# Altium schematic sheet SoC GPIO 3.3V.SchDoc
size A2; DocumentNumber: 11; SheetNumber: 12; SheetTotal: 14
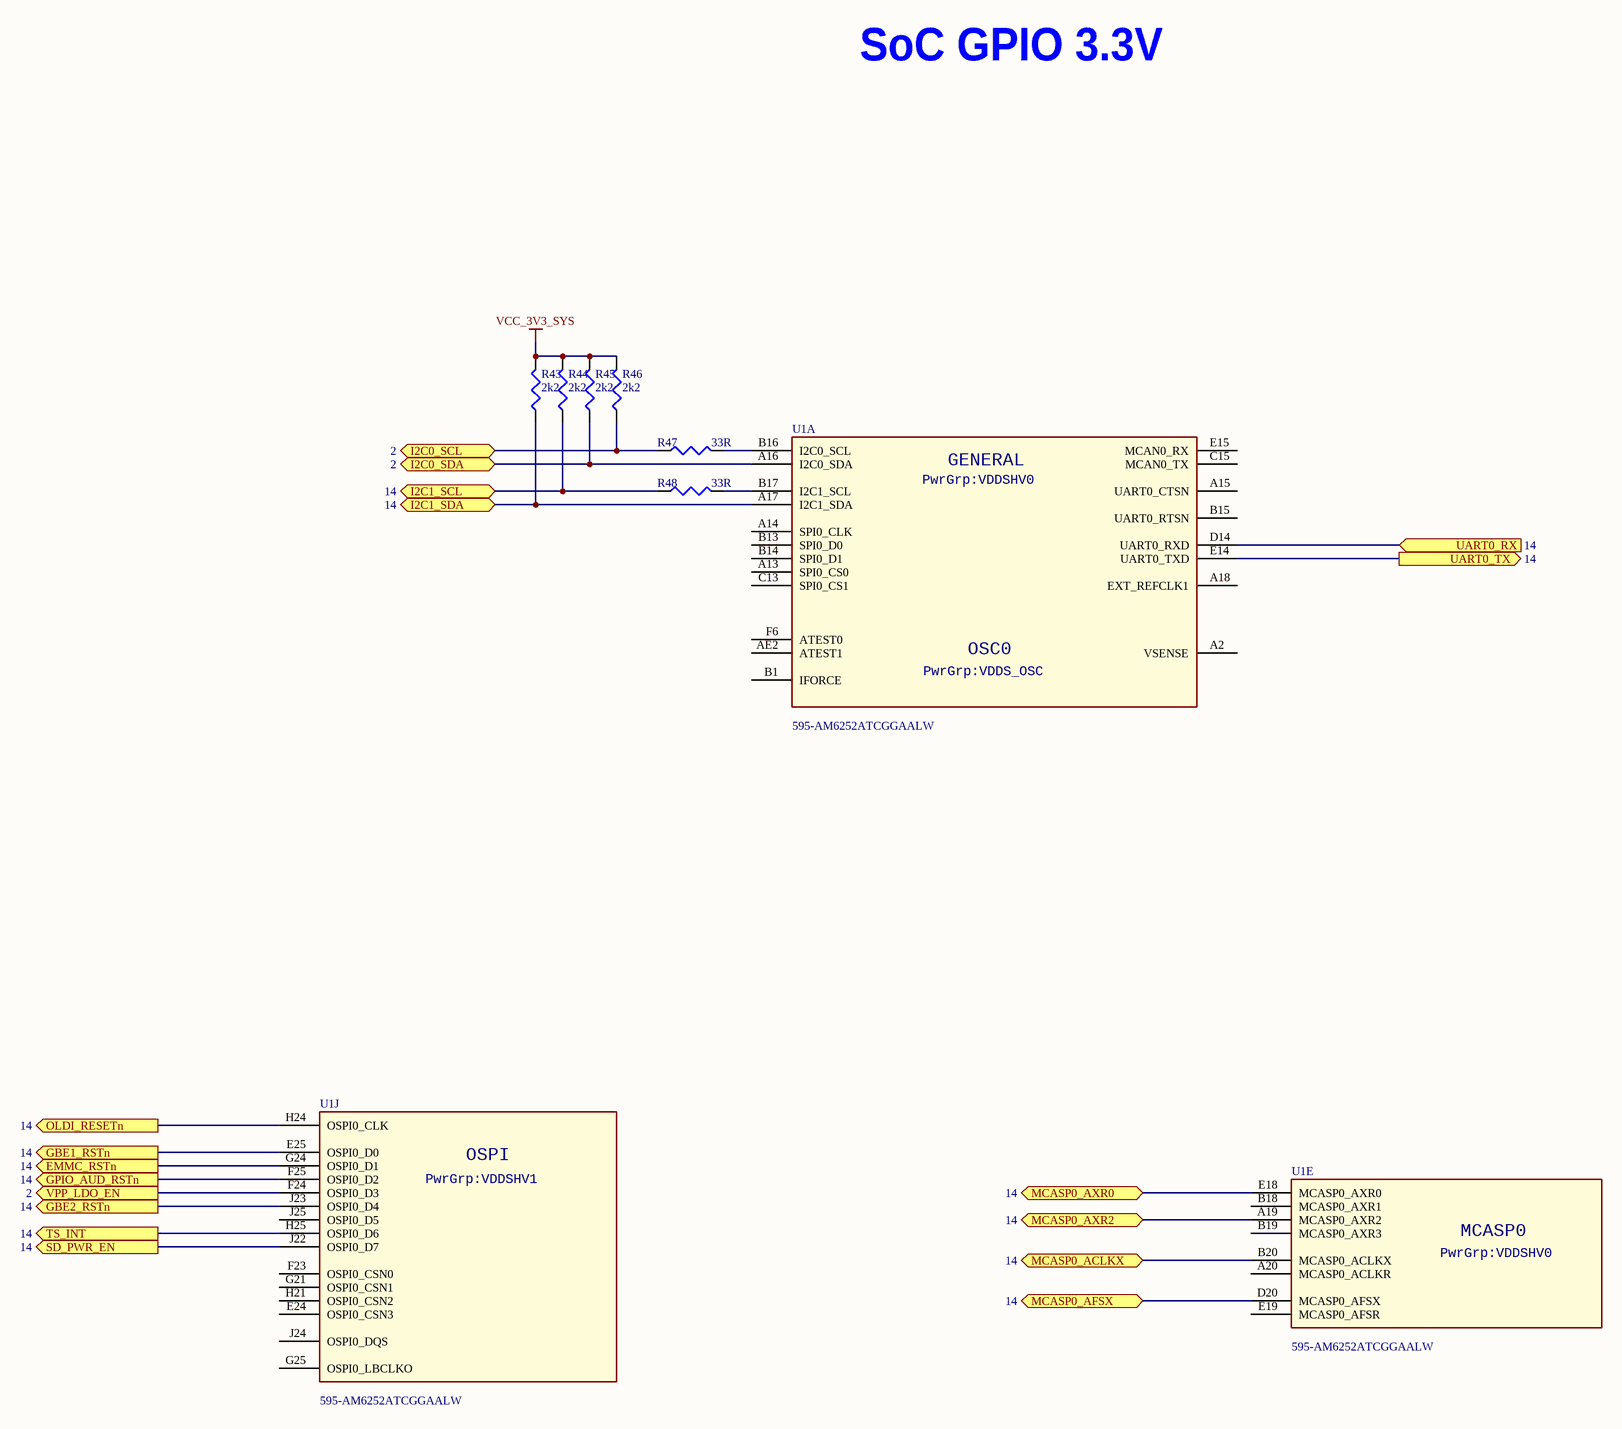
[diagram p0: SoC GPIO 3.3V.SchDoc]

## Parts
R43  2k2  [R0402]
R44  2k2  [R0402]
R45  2k2  [R0402]
R46  2k2  [R0402]
R47  33R  [R0201]
R48  33R  [R0201]
U1  Supplier Part Number 1: 595-AM6252ATCGGAALW  [BGA425C50P25X25_1300X1300X89]  (hidden comment: AM62-EVM_BGA425)  (parts A,E,J of 18)

## Ports
EMMC_RSTn (out, see 14), GBE1_RSTn (out, see 14), GBE2_RSTn (out, see 14), GPIO_AUD_RSTn (out, see 14), I2C0_SCL (bidir, see 2), I2C0_SDA (bidir, see 2), I2C1_SCL (bidir, see 14), I2C1_SDA (bidir, see 14), MCASP0_ACLKX (bidir, see 14), MCASP0_AFSX (bidir, see 14), MCASP0_AXR0 (bidir, see 14), MCASP0_AXR2 (bidir, see 14), OLDI_RESETn (out, see 14), SD_PWR_EN (out, see 14), TS_INT (out, see 14), UART0_RX (in, see 14), UART0_TX (out, see 14), VPP_LDO_EN (out, see 2)

## Nets
VCC_3V3_SYS: R43.2 R44.2 R45.2 R46.2
EMMC_RSTn: U1.G24(OSPI0_D1) ; port EMMC_RSTn
GBE1_RSTn: U1.E25(OSPI0_D0) ; port GBE1_RSTn
GBE2_RSTn: U1.J23(OSPI0_D4) ; port GBE2_RSTn
GPIO_AUD_RSTn: U1.F25(OSPI0_D2) ; port GPIO_AUD_RSTn
I2C0_SCL: R46.1 R47.1 ; port I2C0_SCL
I2C0_SDA: R45.1 U1.A16(I2C0_SDA) ; port I2C0_SDA
I2C1_SCL: R44.1 R48.1 ; port I2C1_SCL
I2C1_SDA: R43.1 U1.A17(I2C1_SDA) ; port I2C1_SDA
MCASP0_ACLKX: U1.B20(MCASP0_ACLKX) ; port MCASP0_ACLKX
MCASP0_AFSX: U1.D20(MCASP0_AFSX) ; port MCASP0_AFSX
MCASP0_AXR0: U1.E18(MCASP0_AXR0) ; port MCASP0_AXR0
MCASP0_AXR2: U1.A19(MCASP0_AXR2) ; port MCASP0_AXR2
OLDI_RESETn: U1.H24(OSPI0_CLK) ; port OLDI_RESETn
SD_PWR_EN: U1.J22(OSPI0_D7) ; port SD_PWR_EN
TS_INT: U1.H25(OSPI0_D6) ; port TS_INT
UART0_RX: U1.D14(UART0_RXD) ; port UART0_RX
UART0_TX: U1.E14(UART0_TXD) ; port UART0_TX
VPP_LDO_EN: U1.F24(OSPI0_D3) ; port VPP_LDO_EN
NetR47_2: R47.2 U1.B16(I2C0_SCL)
NetR48_2: R48.2 U1.B17(I2C1_SCL)

Not connected (* = marked no-connect by the designer): U1 A2(VSENSE) A13(SPI0_CS0) A14(SPI0_CLK) A15(UART0_CTSN) A18(EXT_REFCLK1) A20(MCASP0_ACLKR) AE2(ATEST1) B1(IFORCE) B13(SPI0_D0) B14(SPI0_D1) B15(UART0_RTSN) B18(MCASP0_AXR1) B19(MCASP0_AXR3) C13(SPI0_CS1) C15(MCAN0_TX) E15(MCAN0_RX) E19(MCASP0_AFSR) E24(OSPI0_CSN3) F6(ATEST0) F23(OSPI0_CSN0) G21(OSPI0_CSN1) G25(OSPI0_LBCLKO) H21(OSPI0_CSN2) J24(OSPI0_DQS) J25(OSPI0_D5)

## Notes on the sheet
- SoC GPIO 3.3V
- (in symbol AM62-EVM_BGA425, part A) GENERAL; PwrGrp:VDDSHV0; OSC0; PwrGrp:VDDS_OSC
- (in symbol AM62-EVM_BGA425, part E) MCASP0; PwrGrp:VDDSHV0
- (in symbol AM62-EVM_BGA425, part J) OSPI; PwrGrp:VDDSHV1

## Library data of the parts
R43-R46 = RC0402FR-072K2L: RES 2.20K OHM 1/16W 1% 0402 SMD; Manufacturer: Yageo; Resistance (Ohms): 2.2K; Power (Watts): 0.063W, 1/16W; .Checked PCB: used; Temperature Coefficient: ±100ppm/°C; Category: Resistors; Supplier Part Number: 311-2.20KLRCT-ND; Manufacturer Part Number: RC0402FR-072K2L; Package / Case: 0402 (1005 Metric); Price 1k [$]: 0.01421; Tolerance: ±1%; Value: 2k2; .Checked SCH: used; Supplier: Digikey; Supplier 1: Digi-Key; Supplier Part Number 1: 311-2.20KLRCT-ND; RoHS: RoHS Compliant; Stock 1: 195154; Pricing 1: 10=0.014, 50=0.0104, 100=0.0079, 250=0.00584, 500=0.00432, 1000=0.00288 (USD); Composition: Thick Film; Features: -; Size / Dimension: 0.039" L x 0.020" W (1.00mm x 0.50mm); Height: 0.016" (0.40mm); Number of Terminations: 2; Packaging: Cut Tape (CT); ComponentLink1URL: http://www.yageo.com/documents/recent/PYu-RC0402_51_RoHS_L_6.pdf; ComponentLink1Description: http://www.yageo.com/documents/recent/PYu-RC0402_51_RoHS_L_6.pdf
R47 R48 = RC0201FR-0733RL: RES 33 OHM 1% 1/20W 0201; Manufacturer: Yageo; Power Rating: 50mW; Voltage Rating: 25V; Temperature Coefficient: 200ppm/°C; Supplier 1: Digi-Key; Manufacturer Part Number: RC0201FR-0733RL; Stock 1: 4610000; Pricing 1: 10000=0.0053, 50000=0.0042, 100000=0.0038 (USD); Case/Package: 0201; Case Code (Metric): 0603; Case Code (Imperial): 0201; Size Code: 0201; Min Operating Temperature: -55°C; Max Operating Temperature: 125°C; Resistance: 33R; Tolerance: 1%; Package Quantity: 1; Packaging: Cut Tape; Resistor Type: Thick Film; Number of Terminations: 2; Termination: SMD/SMT; Max Power Dissipation: 50mW; Features: Moisture Resistant; Series: RC; Resistance Tolerance: 1%; Length: 0.024inch; Width: 0.012inch; Height: 0.01inch; Lead Free: Lead Free; RoHS Compliant: Yes; ComponentLink1URL: https://datasheet.ciiva.com/7672/1563626-7672223.pdf?src-supplier=Element14; ComponentLink1Description: https://datasheet.ciiva.com/7672/1563626-7672223.pdf?src-supplier=Element14; ComponentLink2URL: https://datasheet.ciiva.com/22698/1563626-22698520.pdf?src-supplier=Element14; ComponentLink2Description: https://datasheet.ciiva.com/22698/1563626-22698520.pdf?src-supplier=Element14; ComponentLink3URL: https://datasheet.ciiva.com/2560/pyu-r-int-thick-7-2560878.pdf?src-supplier=Digi-Key; ComponentLink3Description: https://datasheet.ciiva.com/2560/pyu-r-int-thick-7-2560878.pdf?src-supplier=Digi-Key; ComponentLink4URL: https://datasheet.ciiva.com/2560/pyu-r-int-thick-7-2560879.pdf?src-supplier=Digi-Key; ComponentLink4Description: https://datasheet.ciiva.com/2560/pyu-r-int-thick-7-2560879.pdf?src-supplier=Digi-Key; ComponentLink5URL: https://datasheet.ciiva.com/2560/pyu-r-int-thick-7-2560877.pdf?src-supplier=Digi-Key; ComponentLink5Description: https://datasheet.ciiva.com/2560/pyu-r-int-thick-7-2560877.pdf?src-supplier=Digi-Key; Supplier Part Number 1: 311-33.0MTR-ND
U1 = AM62-EVM_BGA425: ARM® Cortex®-A53 Microprocessor IC Sitara™ 2 Core, 64-Bit 1.4GHz 425-FCCSP (13x13); Manufacturer: Texas Instruments; Manufacturer Part Number: AM6252ATCGGAALW; Supplier 1: Mouser; Stock 1: 0; Pricing 1: 1=21.23, 10=19.58, 50=18.7, 100=18.7, 1000=15.94, 10000=15.94 (USD)